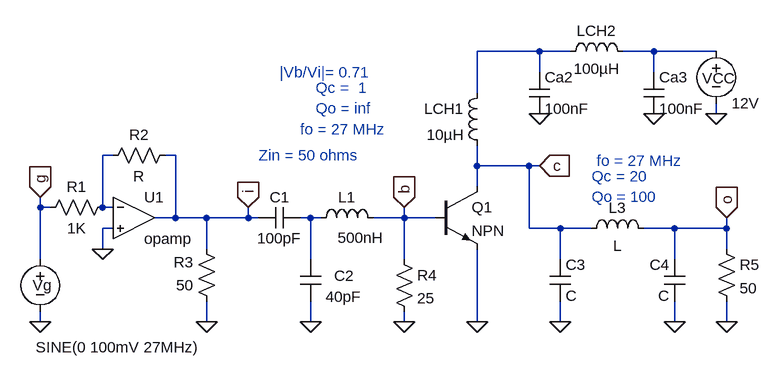
[diagram p0: schematic PA_recu.asc]
PA_recu.asc, the LTspice schematic file:
Version 4
SHEET 1 880 680
WIRE 272 -64 176 -64
WIRE 320 -64 272 -64
WIRE 448 -64 400 -64
WIRE 544 -64 448 -64
WIRE 272 -32 272 -64
WIRE 448 -32 448 -64
WIRE 176 0 176 -64
WIRE 448 32 448 16
WIRE 544 32 544 16
WIRE -384 96 -400 96
WIRE -288 96 -304 96
WIRE 176 112 176 80
WIRE 256 112 176 112
WIRE 272 112 256 112
WIRE 176 144 176 112
WIRE -496 176 -496 160
WIRE -480 176 -496 176
WIRE -400 176 -400 96
WIRE -384 176 -400 176
WIRE -288 192 -288 96
WIRE -288 192 -320 192
WIRE -240 192 -288 192
WIRE -176 192 -176 176
WIRE -176 192 -240 192
WIRE -160 192 -176 192
WIRE -80 192 -96 192
WIRE -64 192 -80 192
WIRE 64 192 64 176
WIRE 64 192 16 192
WIRE 112 192 64 192
WIRE -384 208 -400 208
WIRE 256 208 256 112
WIRE 304 208 256 208
WIRE 352 208 304 208
WIRE 480 208 432 208
WIRE 560 208 560 192
WIRE 560 208 480 208
WIRE -400 240 -400 208
WIRE -240 240 -240 192
WIRE 560 240 560 208
WIRE -496 256 -496 176
WIRE -80 256 -80 192
WIRE 64 256 64 192
WIRE 304 256 304 208
WIRE 480 256 480 208
WIRE -496 352 -496 336
WIRE -240 352 -240 320
WIRE -80 352 -80 320
WIRE 64 352 64 336
WIRE 176 352 176 240
WIRE 304 352 304 320
WIRE 480 352 480 320
WIRE 560 352 560 320
FLAG 176 352 0
FLAG 304 352 0
FLAG 560 352 0
FLAG 448 32 0
FLAG 272 32 0
FLAG -80 352 0
FLAG 480 352 0
FLAG 64 352 0
FLAG -496 352 0
FLAG 272 112 c
IOPIN 272 112 In
FLAG 64 176 b
IOPIN 64 176 In
FLAG 560 192 o
IOPIN 560 192 In
FLAG -176 176 i
IOPIN -176 176 In
FLAG -496 160 g
IOPIN -496 160 In
FLAG 544 32 0
FLAG -400 240 0
FLAG -240 352 0
SYMBOL ind 192 -16 M0
SYMATTR InstName LCH1
SYMATTR Value 10µH
SYMBOL cap 288 256 R0
SYMATTR InstName C3
SYMBOL cap 496 320 R180
WINDOW 0 24 56 Left 2
WINDOW 3 24 8 Left 2
SYMATTR InstName C4
SYMBOL res 544 224 R0
SYMATTR InstName R5
SYMATTR Value 50
SYMBOL voltage 544 -80 R0
WINDOW 0 -22 57 Left 2
SYMATTR InstName VCC
SYMATTR Value 12V
SYMBOL cap 432 -32 R0
SYMATTR InstName Ca3
SYMATTR Value 100nF
SYMBOL ind 304 -48 R270
WINDOW 0 32 56 VTop 2
WINDOW 3 5 56 VBottom 2
SYMATTR InstName LCH2
SYMATTR Value 100µH
SYMBOL cap 256 -32 R0
SYMATTR InstName Ca2
SYMATTR Value 100nF
SYMBOL cap -96 256 R0
WINDOW 0 52 25 Left 2
WINDOW 3 39 57 Left 2
SYMATTR InstName C2
SYMATTR Value 40pF
SYMBOL cap -96 176 R90
WINDOW 0 0 32 VBottom 2
WINDOW 3 32 32 VTop 2
SYMATTR InstName C1
SYMATTR Value 100pF
SYMBOL ind -80 208 R270
WINDOW 0 32 56 VTop 2
WINDOW 3 1 77 VBottom 2
SYMATTR InstName L1
SYMATTR Value 500nH
SYMBOL ind 336 224 R270
WINDOW 0 32 56 VTop 2
WINDOW 3 5 56 VBottom 2
SYMATTR InstName L3
SYMBOL npn 112 144 R0
SYMATTR InstName Q1
SYMBOL res 48 240 R0
SYMATTR InstName R4
SYMATTR Value 25
SYMBOL res -224 336 R180
WINDOW 0 36 76 Left 2
WINDOW 3 36 40 Left 2
SYMATTR InstName R3
SYMATTR Value 50
SYMBOL Opamps\\opamp -352 128 R0
SYMATTR InstName U1
SYMBOL voltage -496 240 R0
WINDOW 0 -12 56 Left 2
WINDOW 123 0 0 Left 0
WINDOW 39 0 0 Left 0
WINDOW 3 -7 151 Left 2
SYMATTR InstName Vg
SYMATTR Value SINE(0 100mV 27MHz)
SYMBOL res -384 160 R90
WINDOW 0 0 56 VBottom 2
WINDOW 3 32 56 VTop 2
SYMATTR InstName R1
SYMATTR Value 1K
SYMBOL res -288 80 R90
WINDOW 0 0 56 VBottom 2
WINDOW 3 32 56 VTop 2
SYMATTR InstName R2
TEXT 352 128 Left 2 ;Qc = 20\nQo = 100
TEXT 360 104 Left 2 ;fo = 27 MHz
TEXT -128 -32 Left 2 ;|Vb/Vi|= 0.71
TEXT -96 56 Left 2 ;fo = 27 MHz
TEXT -160 96 Left 2 ;Zin = 50 ohms
TEXT -72 -8 Left 2 ;Qc =  1\nQo = inf

The netlist it stands for:
* PA_recu.asc
LCH1 N001 c 10µH
C3 c 0 C
C4 0 o C
R5 o 0 50
VCC N002 0 12V
Ca3 N002 0 100nF
LCH2 N001 N002 100µH
Ca2 N001 0 100nF
C2 N004 0 40pF
C1 N004 i 100pF
L1 N004 b 500nH
L3 c o L
Q1 c b 0 0 NPN
R4 b 0 25
R3 0 i 50
XU1 N003 0 i opamp Aol=100K GBW=10Meg  ; pins invin noninvin out
Vg g 0 SINE(0 100mV 27MHz)
R1 N003 g 1K
R2 i N003 R
.model NPN NPN
.model PNP PNP
.lib standard.bjt
* Qc = 20
* Qo = 100
* fo = 27 MHz
* |Vb/Vi|= 0.71
* fo = 27 MHz
* Zin = 50 ohms
* Qc =  1
* Qo = inf
.backanno
.end